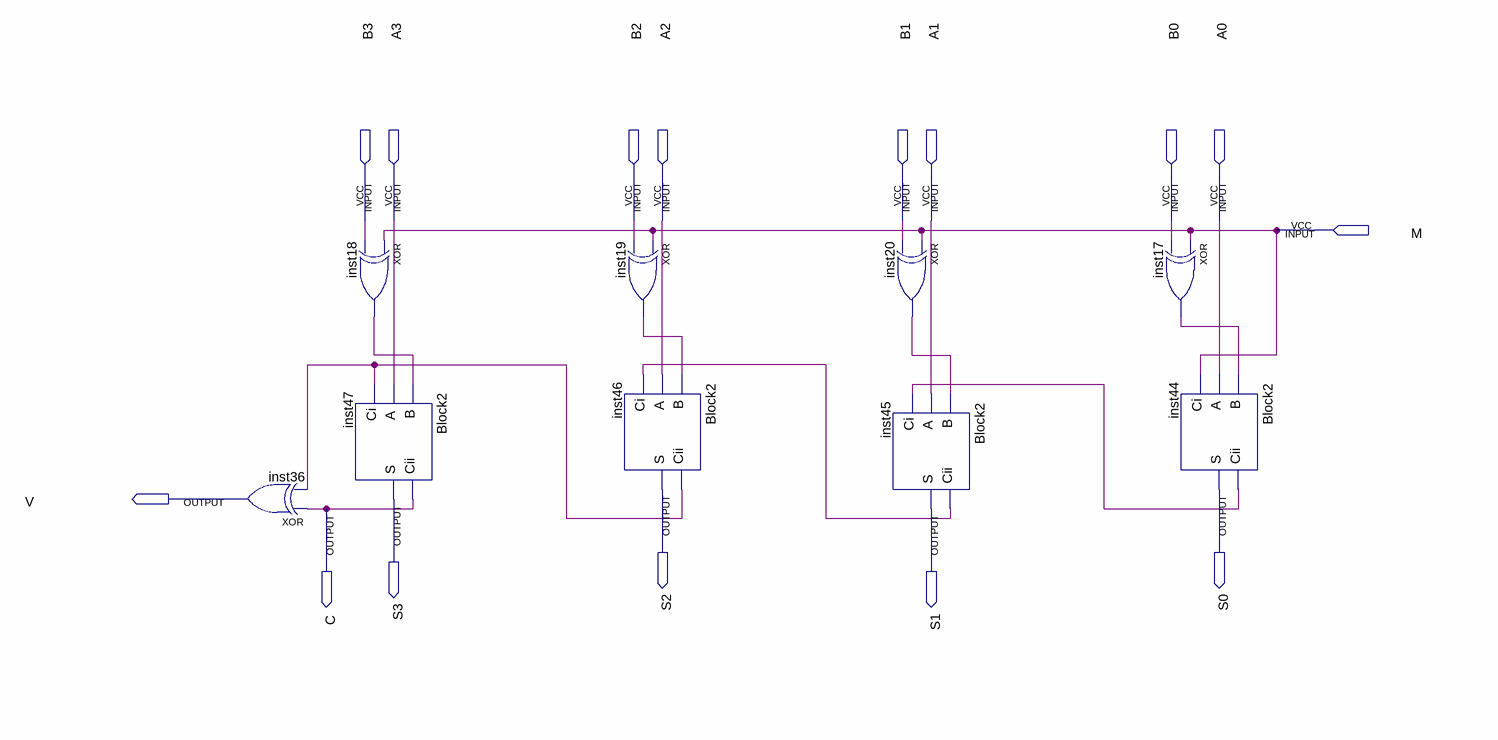
[diagram p0: schematic sheet]
// Quartus schematic s1111403_lab3.bdf as structural Verilog: 9 symbols, 15 pins
module s1111403_lab3 (
  input  B3,
  input  A3,
  input  B2,
  input  A2,
  input  B1,
  input  A1,
  input  B0,
  input  A0,
  input  M,
  output S2,
  output S0,
  output V,
  output S3,
  output C,
  output S1
);

  wire inst17_out, inst18_out, inst19_out, inst20_out, inst44_cii, inst45_cii, inst46_cii;

  xor inst36 (V, C, inst46_cii);
  xor inst18 (inst18_out, M, B3);
  Block2 inst47 (.B(inst18_out), .A(A3), .Ci(inst46_cii), .Cii(C), .S(S3));
  Block2 inst46 (.B(inst19_out), .A(A2), .Ci(inst45_cii), .Cii(inst46_cii), .S(S2));
  xor inst19 (inst19_out, M, B2);
  xor inst20 (inst20_out, M, B1);
  Block2 inst45 (.B(inst20_out), .A(A1), .Ci(inst44_cii), .Cii(inst45_cii), .S(S1));
  xor inst17 (inst17_out, M, B0);
  Block2 inst44 (.B(inst17_out), .A(A0), .Ci(M), .Cii(inst44_cii), .S(S0));
endmodule
